# Altium schematic sheet Color_sensor.SchDoc
size A
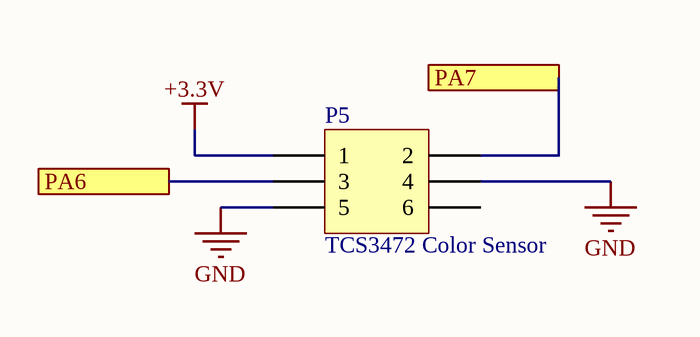
[diagram p0: Color_sensor.SchDoc]

## Parts
P5  TCS3472 Color Sensor  [HDR2X3]

## Ports
PA6, PA7

## Nets
+3.3V: P5.1
GND: P5.4 P5.5
PA6: P5.3 ; port PA6
PA7: P5.2 ; port PA7

Not connected (* = marked no-connect by the designer): P5 6

## Library data of the parts
P5 = Header 3X2: Header, 3-Pin, Dual row; LatestRevisionDate: 17-Jul-2002; LatestRevisionNote: Re-released for DXP Platform.; Publisher: Altium Limited